# EAGLE design water_buzzer (EAGLE 9.4.2)
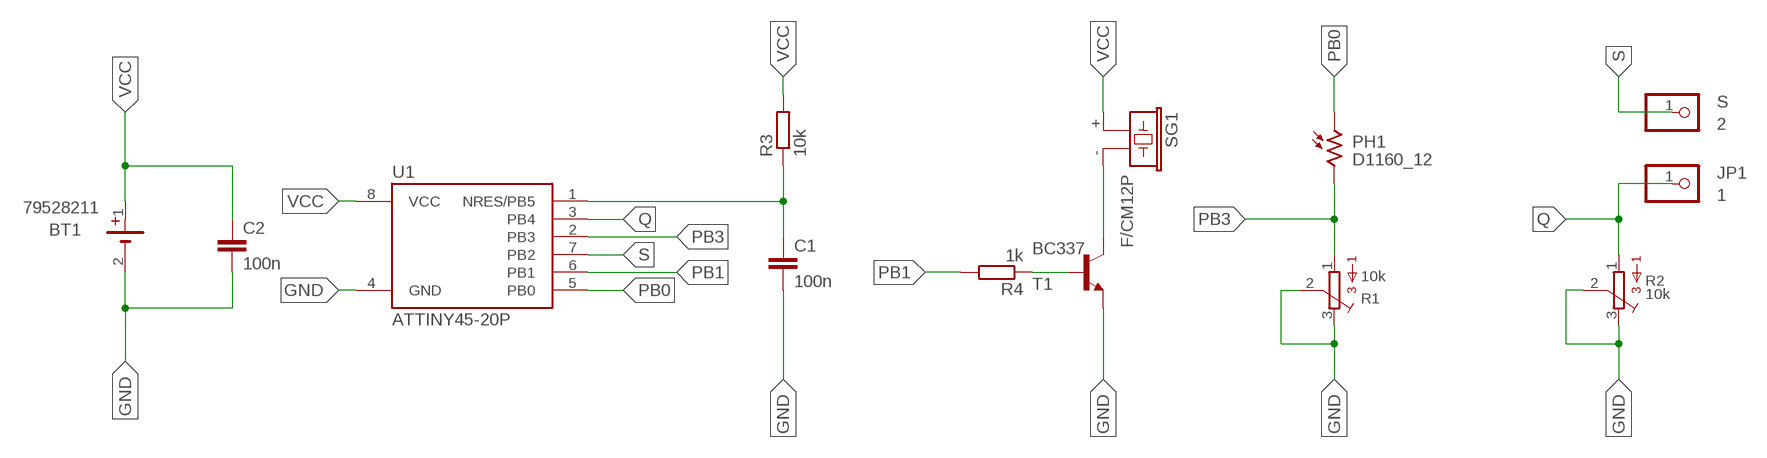
[diagram p0: schematic, sheet 1]

## Parts
BT1  79528211  [79528211]
C1  100n  C5/2.5  [C5B2.5]
C2  100n  C5/2.5  [C5B2.5]
JP1  1  PINHD-1X1  [1X01]
PH1  D1160_12  [D11XX]
R1  10k  3362H  [3362H]
R2  10k  3362H  [3362H]
R3  10k  R-EU_0204/7  [0204/7]
R4  1k  R-EU_0204/7  [0204/7]
S  2  PINHD-1X1  [1X01]
SG1  F/CM12P  [F/CM12P]
T1  BC337  [TO92]
U1  ATTINY45-20P  [PDIP08_300MIL]

## Nets
GND: BT1.2(-) C1.2 C2.2 R1.2 R1.3 R2.2 R2.3 T1.1(E) U1.4(GND)
N$1: C1.1 R3.1 U1.1(NRES/PB5)
N$2: SG1.- T1.3(C)
N$5: R4.1 T1.2(B)
PB0: PH1.1 U1.5(PB0)
PB1: R4.2 U1.6(PB1)
PB3: PH1.2 R1.1 U1.2(PB3)
Q: JP1.1 R2.1 U1.3(PB4)
S: S.1 U1.7(PB2)
VCC: BT1.1(+) C2.1 R3.2 SG1.+ U1.8(VCC)

## Library data of the parts
BT1 = Battery Holder:79528211: BATTERY HOLDER COIN 20MM PC PIN Manufacturer's datasheet <https://katalog.we-online.de/em/datasheet/79528211.pdf>; CREATED_BY: PCBLayout.com; DIGIKEY_PART_NO: 732-12326-ND; MANUFACTURER: Wurth Electronics Inc.; MPN: 79528211
C1 C2 = capacitor-wima:C: CAPACITOR naming: grid - package width
JP1 S = adafruit:PINHD-1X1: Pin header 1x1 for 0.1" spacing With round pins
PH1 = photo-elements:D11: Photo Sensor Oil Burner Control Applications Source: http://optoelectronics.perkinelmer.com/content/Datasheets/DTS_PhotocellsD1160.pdf
R1 R2 = bourns:3362: 3362 Series 1/4" Square Trimmer
R3 R4 = rcl:R-EU_: RESISTOR, European symbol; SPICEPREFIX: R
SG1 = buzzer:F/CM12P: BUZZER Source: Buerklin; OC_FARNELL: unknown; OC_NEWARK: unknown
T1 = transistor:BC337: NPN TRANSISTOR
U1 = _hhn_attiny25_45_85:ATTINY45*: ATMEL ATtiny 45 Packages: P = PDIP 08 30mil S = SOIC 08 EIAJ 208mil X = TSSOP 08 4.4mm Technologies Note: for complete ordering code (temp. range, finish, tape&reel etc.) see www.atmel.com • Supply Voltage: V = (1.8…5.5)V | [blank] = (2.7…5.5)V • Speed: 10 = 10 MHz | 20 = 20 MHz Author: Dipl.-Ing. FH Rainer Bayer HHN Hochschule Heilbronn (Heilbronn University), rainer.bayer@hs-heilbronn.de Ingenieurbüro ing-rb, mail@ing-rb.de

## Board
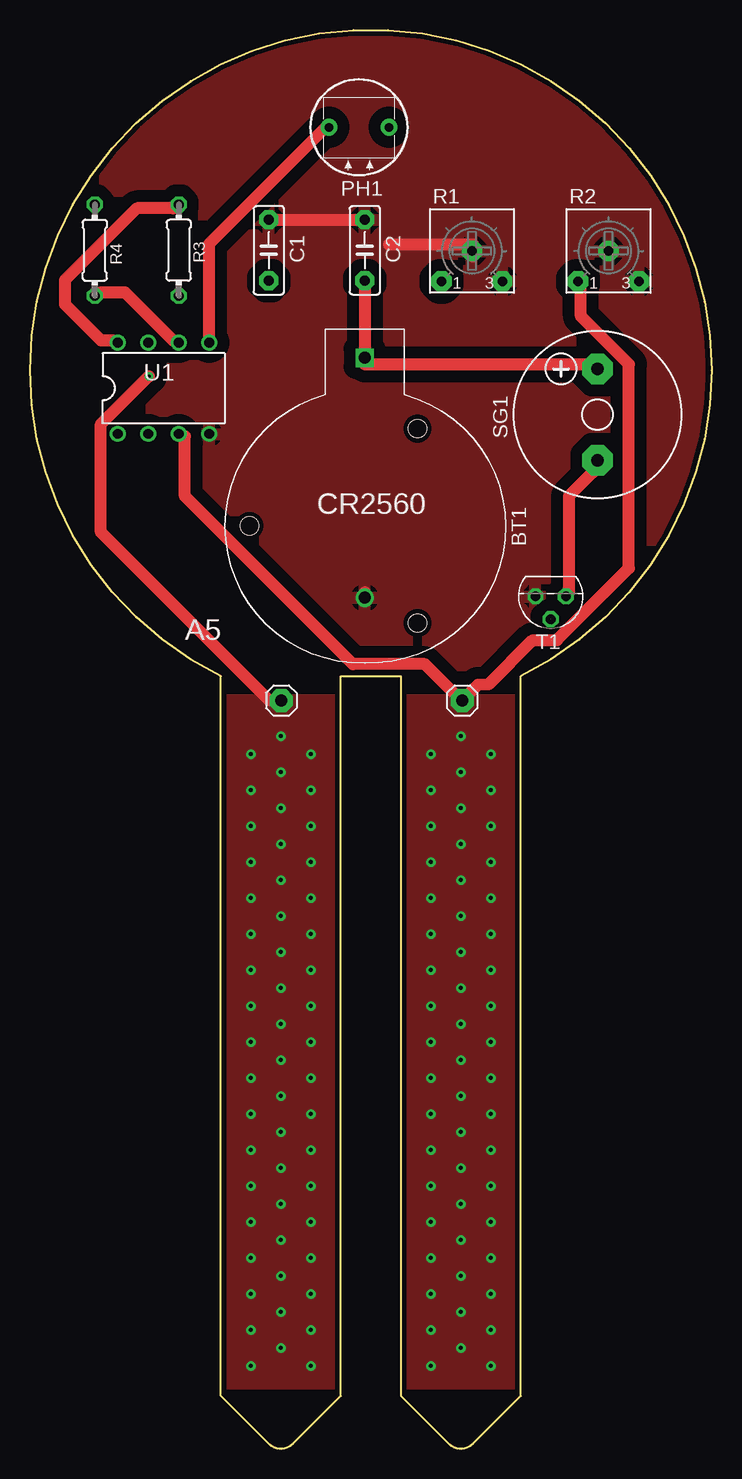
[diagram p1: board, top side]
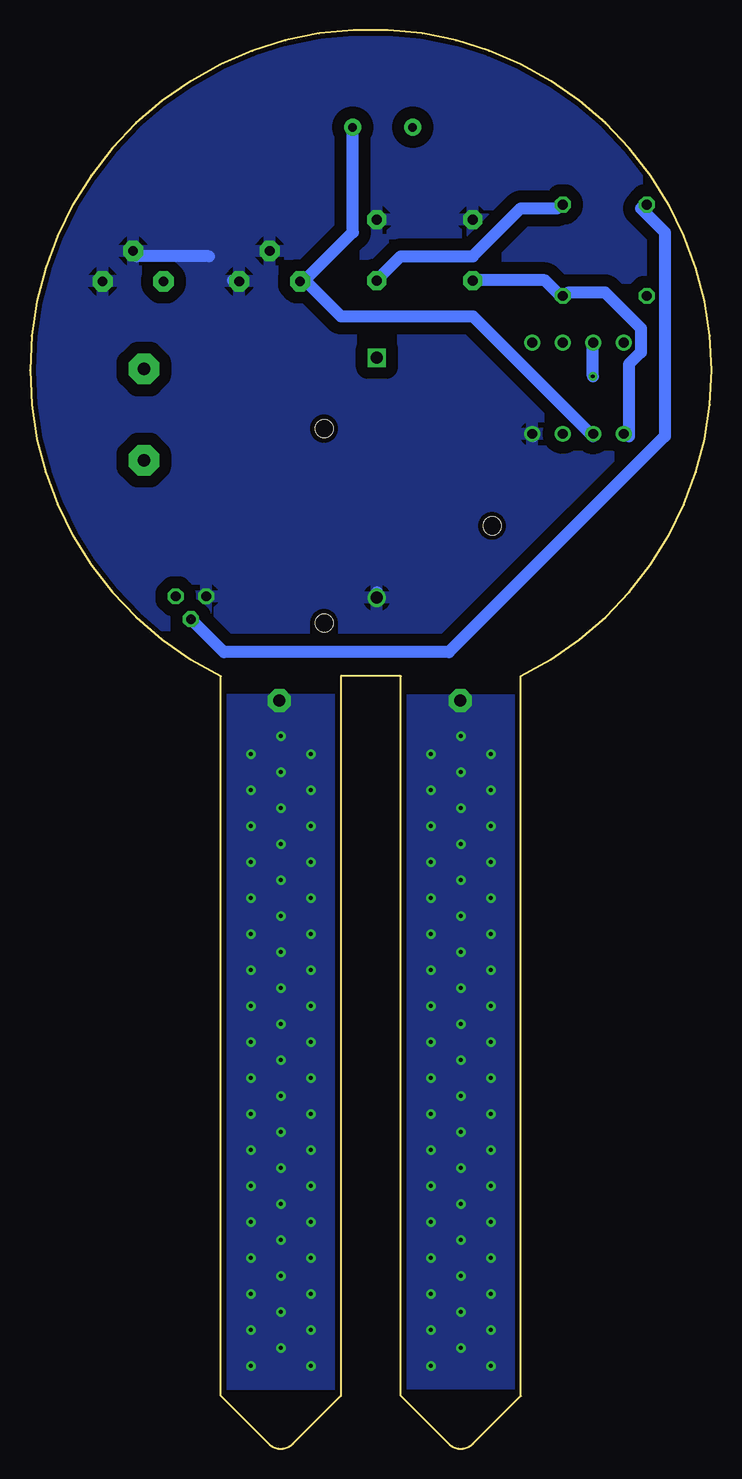
[diagram p2: board, bottom side, seen from below]

Size 56.8 x 118.28 mm. Coordinates in mm from the lower left corner, seen from the top.
Outline: 30.9,64.41 30.9,4.41 34.9,0.41 arc90 36.9,0.41 40.9,4.41 40.9,64.41 arc308 15.9,64.41 15.9,4.41 19.9,0.41 arc90 21.9,0.41 25.9,4.41 25.9,64.41 30.9,64.41
Copper layers (1+2*3+16): Top 0.035mm / dielectric 1.5mm / Route2 0.035mm / dielectric 0.15mm / Route3 0.035mm / dielectric 0.2mm / Bottom 0.035mm
Design rules "design-rules-1x *": minimum track width 1mm, minimum drill 0.3mm, track to track 1mm, track to pad 8mil, pad to pad 7mil, via to via 8mil, smd to smd 0mil, copper to edge 16mil, drill to drill 8mil, minimum pad ring 10mil, minimum via ring 8mil, stop-mask expansion 4mil, vias tented up to drill 20mil, thermal gap 16mil

### Footprints (pad centres in the part's own frame; a part is rotated, then mirrored left to right if it is on the bottom)
79528211 = drill 1 square: 1 -14,0 | drill 1: 2 6,0 | hole 1.5: -8.1,4.4; 8.1,4.4; 0,-9.6
C5B2.5 = drill 0.813 pad 1.6 octagon: 1 -2.54,0; 2 2.54,0
1X01 = drill 1.016 pad 1.93 octagon: 1 0,0
D11XX = drill 0.7 pad 1.4: 1 -2.5,0; 2 2.5,0
3362H = drill 0.813 pad 1.676 octagon: 1 -2.54,-3.175; 2 0,-0.635; 3 2.54,-3.175
0204/7 = drill 0.813 octagon: 1 -3.81,0; 2 3.81,0
F/CM12P = drill 1.016 pad 2.54 octagon: + 3.81,0; - -3.81,0
TO92 = drill 0.813 octagon: 1 1.27,0; 2 0,1.905; 3 -1.27,0
PDIP08_300MIL = drill 0.813: 1 -3.81,-3.81; 2 -1.27,-3.81; 3 1.27,-3.81; 4 3.81,-3.81; 5 3.81,3.81; 6 1.27,3.81; 7 -1.27,3.81; 8 -3.81,3.81

### Placement (x,y rotation side)
BT1  27.89,76.94 270 top
C1  19.9,99.91 90 top
C2  27.9,99.91 90 top
JP1  36.02,62.37 0 top
PH1  27.41,110.16 0 top
R1  36.83,100.49 0 top
R2  48.21,100.49 0 top
R3  12.4,99.91 90 top
R4  5.4,99.91 270 top
S  20.94,62.37 0 top
SG1  47.3,86.21 90 top
T1  43.39,71.06 180 top
U1  11.13,88.41 0 top

### Tracks (layer width: path | path; a pad name or v marks a point on that pad's centre or on a via)
GND
  Top 1: 36.9,99.41 R1.2 36.9,100.41 29.9,100.41 | 38.9,97.41 R1.3 | C1.2 19.9,102.41 27.9,102.41 C2.2 | 27.9,71.41 BT1.2
  Bottom 1: 41.9,99.41 47.9,99.41 | 14.9,84.41 U1.4 | 27.9,71.41 BT1.2 | 39.9,97.41 R1.3
  pour Top (isolate 0.406): -2.1,64.41 58.9,64.41 58.9,120.41 -2.1,120.41
  pour Bottom (isolate 0.406): -4.1,64.41 60.9,64.41 60.9,122.41 -4.1,122.41
N$1
  Bottom 1: U1.1 6.9,84.41 6.9,90.41 5.9,91.41 5.9,93.41 8.9,96.41 11.9,96.41 R3.1 12.9,96.41 13.9,97.41 19.9,97.41 C1.1
N$2
  Top 1: T1.3 44.9,71.41 44.9,79.41 46.9,81.41 SG1.-
N$5  (1 unrouted)
  Bottom 1: T1.2 40.65,66.41 21.9,66.41 3.9,84.41 3.9,101.41 5.9,103.41 R4.1
PB0
  Top 1: U1.5 14.9,92.41 14.9,100.41 24.9,110.41 PH1.1
PB1
  Top 1: U1.6 11.9,92.41 7.9,96.41 5.9,96.41 R4.2
PB3
  Bottom 1: 33.9,97.41 30.9,94.41 19.9,94.41 9.9,84.41 U1.2 | 33.9,97.41 29.9,101.41 29.9,110.41 PH1.2 | 33.9,97.41 R1.1
Q  (via drill 0.35)
  Top 1: U1.3 12.9,84.41 12.9,79.41 26.9,65.41 32.9,65.41 35.9,62.41 JP1.1 37.33,63.68 38.21,63.72 41.9,67.41 43.9,67.41 49.9,73.41 49.9,90.41 45.9,94.41 45.9,97.41 R2.1
  Bottom 1: 35.9,62.38 JP1.1
  other vias: 35.9,59.41 33.4,57.91 35.9,56.41 38.4,57.91 33.4,54.91 38.4,54.91 35.9,53.41 33.4,51.91 38.4,51.91 35.9,50.41 38.4,48.91 33.4,48.91 35.9,47.41 33.4,45.91 38.4,45.91 35.9,44.41 33.4,42.91 38.4,42.91 35.9,41.41 33.4,39.91 38.4,39.91 35.9,38.41 33.4,36.91 38.4,36.91 35.9,35.41 33.4,33.91 38.4,33.91 35.9,32.41 38.4,30.91 33.4,30.91 35.9,29.41 33.4,27.91 38.4,27.91 35.9,26.41 33.4,24.91 38.4,24.91 35.9,23.41 33.4,21.91 38.4,21.91 35.9,20.41 33.4,18.91 38.4,18.91 35.9,17.41 33.4,15.91 38.4,15.91 33.4,12.91 35.9,14.41 38.4,12.91 35.9,11.41 33.4,9.91 35.9,8.41 33.4,6.91 38.4,6.91 38.4,9.91
  pour Top (no thermals): 29.9,62.41 42.9,62.41 42.9,5.41 29.9,5.41
  pour Bottom (no thermals): 29.9,62.41 44.9,62.41 44.9,5.41 29.9,5.41
S  (via drill 0.3, 0.35)
  Top 1: v9.9,89.41 5.9,85.41 5.9,76.41 19.89,62.43 S.1
  Bottom 1: v9.9,89.41 9.9,92.41 U1.7
  other vias: 20.9,59.41 18.4,57.91 20.9,56.41 23.4,57.91 18.4,54.91 18.4,51.91 20.9,53.41 23.4,54.91 23.4,51.91 20.9,50.41 18.4,48.91 20.9,47.41 23.4,48.91 18.4,45.91 23.4,45.91 20.9,44.41 18.4,42.91 23.4,42.91 20.9,41.41 18.4,39.91 23.4,39.91 20.9,38.41 18.4,36.91 23.4,36.91 20.9,35.41 18.4,33.91 23.4,33.91 20.9,32.41 18.4,30.91 20.9,29.41 23.4,30.91 23.4,27.91 18.4,27.91 20.9,26.41 23.4,24.91 18.4,24.91 20.9,23.41 23.4,21.91 18.4,21.91 20.9,20.41 23.4,18.91 18.4,18.91 20.9,17.41 18.4,15.91 20.9,14.41 23.4,15.91 18.4,12.91 20.9,11.41 23.4,12.91 23.4,9.91 18.4,9.91 20.9,8.41 18.4,6.91 23.4,6.91
  pour Top (no thermals): 13.9,62.41 26.9,62.41 26.9,5.41 13.9,5.41
  pour Bottom (no thermals): 26.9,62.41 11.9,62.41 11.9,5.41 26.9,5.41
VCC
  Top 1: U1.8 6.9,92.41 5.9,92.41 2.9,95.41 2.9,97.41 8.9,103.41 11.9,103.41 R3.2 | 27.9,97.41 C2.1 27.9,91.41 BT1.1 27.9,90.41 46.9,90.41 SG1.+
  Bottom 1: R3.2 12.9,103.41 15.9,103.41 19.9,99.41 25.9,99.41 27.9,97.41 C2.1

### Text on the board
_tNames: CR2560 | A5